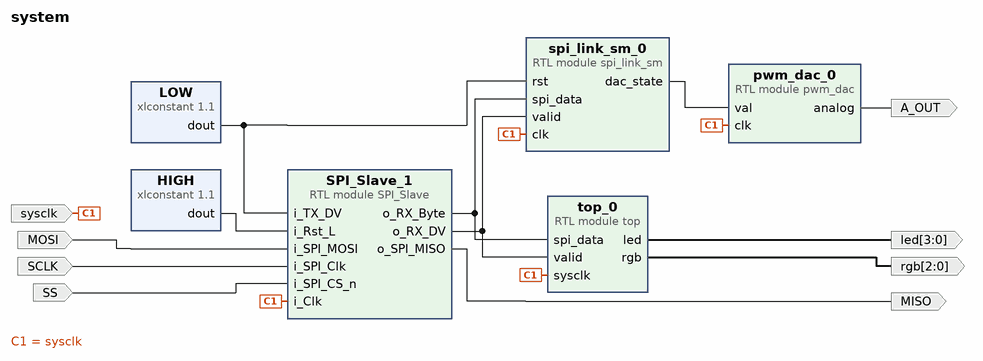
[diagram p0: block diagram of the top level]
# Vivado block design system, xc7z020clg400-1, Vivado 2022.2
create_bd_design system

create_bd_port -dir I MOSI
create_bd_port -dir I SCLK
create_bd_port -dir O A_OUT
create_bd_port -dir O MISO
create_bd_port -dir I SS
create_bd_port -dir O -from 3 -to 0 led
create_bd_port -dir O -from 2 -to 0 rgb
create_bd_port -dir I sysclk

create_bd_cell -type ip -vlnv xilinx.com:ip:xlconstant:1.1 HIGH
create_bd_cell -type ip -vlnv xilinx.com:ip:xlconstant:1.1 LOW
set_property -dict {CONFIG.CONST_VAL 0} [get_bd_cells LOW]
create_bd_cell -type module -reference pwm_dac pwm_dac_0
create_bd_cell -type module -reference top top_0
create_bd_cell -type module -reference SPI_Slave SPI_Slave_1
create_bd_cell -type module -reference spi_link_sm spi_link_sm_0

# ---- connections ----

connect_bd_net [get_bd_pins HIGH/dout] [get_bd_pins SPI_Slave_1/i_Rst_L]
connect_bd_net [get_bd_pins LOW/dout] [get_bd_pins SPI_Slave_1/i_TX_DV] [get_bd_pins spi_link_sm_0/rst]
connect_bd_net [get_bd_ports MOSI] [get_bd_pins SPI_Slave_1/i_SPI_MOSI]
connect_bd_net [get_bd_ports SCLK] [get_bd_pins SPI_Slave_1/i_SPI_Clk]
connect_bd_net -net SPI_Slave_0_o_RX_Byte [get_bd_pins SPI_Slave_1/o_RX_Byte] [get_bd_pins top_0/spi_data] [get_bd_pins spi_link_sm_0/spi_data]
connect_bd_net -net SPI_Slave_0_o_RX_DV [get_bd_pins SPI_Slave_1/o_RX_DV] [get_bd_pins top_0/valid] [get_bd_pins spi_link_sm_0/valid]
connect_bd_net [get_bd_pins SPI_Slave_1/o_SPI_MISO] [get_bd_ports MISO]
connect_bd_net [get_bd_ports SS] [get_bd_pins SPI_Slave_1/i_SPI_CS_n]
connect_bd_net -net processing_system7_0_FCLK_CLK0 [get_bd_ports sysclk] \
  [get_bd_pins pwm_dac_0/clk] [get_bd_pins top_0/sysclk] [get_bd_pins SPI_Slave_1/i_Clk] [get_bd_pins spi_link_sm_0/clk]
connect_bd_net [get_bd_pins pwm_dac_0/analog] [get_bd_ports A_OUT]
connect_bd_net [get_bd_pins spi_link_sm_0/dac_state] [get_bd_pins pwm_dac_0/val]
connect_bd_net [get_bd_pins top_0/led] [get_bd_ports led]
connect_bd_net [get_bd_pins top_0/rgb] [get_bd_ports rgb]

validate_bd_design
save_bd_design
